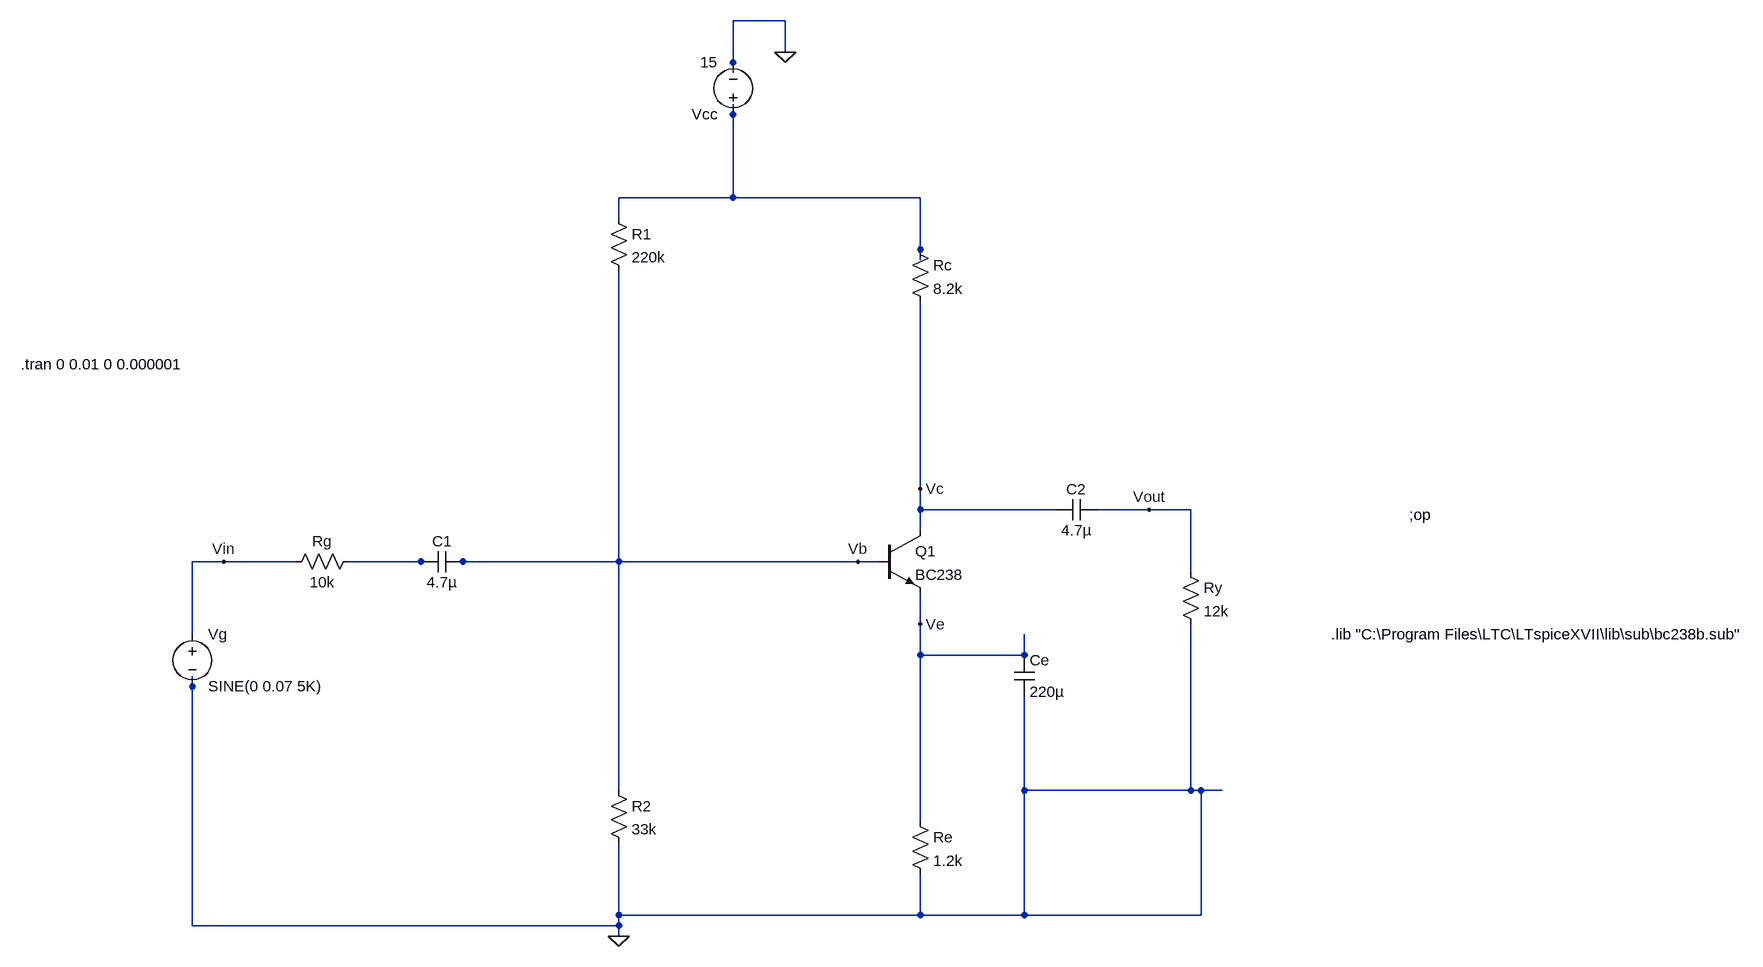
[diagram p0: schematic bjt trimmer simulation.asc]
bjt trimmer simulation.asc, the LTspice schematic file:
Version 4
SHEET 1 2680 740
WIRE 688 -688 608 -688
WIRE 688 -640 688 -688
WIRE 608 -624 608 -688
WIRE 608 -608 608 -624
WIRE 608 -544 608 -560
WIRE 608 -416 608 -544
WIRE 608 -416 432 -416
WIRE 896 -416 608 -416
WIRE 432 -384 432 -416
WIRE 896 -336 896 -416
WIRE 896 -320 896 -336
WIRE 896 32 896 -256
WIRE 896 64 896 32
WIRE 1104 64 896 64
WIRE 1248 64 1168 64
WIRE 1312 64 1248 64
WIRE 896 96 896 64
WIRE -176 144 -224 144
WIRE -64 144 -176 144
WIRE 128 144 16 144
WIRE 144 144 128 144
WIRE 192 144 176 144
WIRE 432 144 432 -304
WIRE 432 144 192 144
WIRE 800 144 432 144
WIRE 832 144 800 144
WIRE 1312 160 1312 64
WIRE 896 240 896 192
WIRE -224 256 -224 144
WIRE 896 288 896 240
WIRE 1056 288 1056 256
WIRE 1056 288 896 288
WIRE -224 336 -224 320
WIRE 432 496 432 144
WIRE 1056 496 1056 352
WIRE 1312 496 1312 240
WIRE 1312 496 1056 496
WIRE 1328 496 1312 496
WIRE 1360 496 1328 496
WIRE 896 544 896 288
WIRE 432 688 432 576
WIRE 896 688 896 624
WIRE 896 688 432 688
WIRE 1056 688 1056 496
WIRE 1056 688 896 688
WIRE 1328 688 1328 496
WIRE 1328 688 1056 688
WIRE -224 704 -224 336
WIRE 432 704 432 688
WIRE 432 704 -224 704
WIRE 432 720 432 704
FLAG 432 720 0
FLAG 688 -640 0
FLAG 800 144 Vb
FLAG 896 240 Ve
FLAG 896 32 Vc
FLAG 1248 64 Vout
FLAG -176 144 Vin
DATAFLAG 672 144 ""
DATAFLAG 896 368 ""
DATAFLAG 896 -112 ""
DATAFLAG -224 496 ""
SYMBOL res 32 128 R90
WINDOW 0 0 56 VBottom 2
WINDOW 3 32 56 VTop 2
SYMATTR InstName Rg
SYMATTR Value 10k
SYMBOL res 416 480 R0
SYMATTR InstName R2
SYMATTR Value 33k
SYMBOL res 416 -400 R0
SYMATTR InstName R1
SYMATTR Value 220k
SYMBOL res 880 -352 R0
SYMATTR InstName Rc
SYMATTR Value 8.2k
SYMBOL res 880 528 R0
SYMATTR InstName Re
SYMATTR Value 1.2k
SYMBOL res 1296 144 R0
SYMATTR InstName Ry
SYMATTR Value 12k
SYMBOL cap 1168 48 R90
WINDOW 0 0 32 VBottom 2
WINDOW 3 32 32 VTop 2
SYMATTR InstName C2
SYMATTR Value 4.7µ
SYMBOL cap 192 128 R90
WINDOW 0 0 32 VBottom 2
WINDOW 3 32 32 VTop 2
SYMATTR InstName C1
SYMATTR Value 4.7µ
SYMBOL cap 1040 288 R0
SYMATTR InstName Ce
SYMATTR Value 220µ
SYMBOL voltage -224 240 R0
WINDOW 123 0 0 Left 0
WINDOW 39 0 0 Left 0
SYMATTR InstName Vg
SYMATTR Value SINE(0 0.07 5K)
SYMBOL voltage 608 -528 R180
WINDOW 123 0 0 Left 0
WINDOW 39 0 0 Left 0
SYMATTR InstName Vcc
SYMATTR Value 15
SYMBOL npn 832 96 R0
SYMATTR InstName Q1
SYMATTR Value BC238
TEXT 1648 72 Left 2 !;op
TEXT 1528 256 Left 2 !.lib "C:\\Program Files\\LTC\\LTspiceXVII\\lib\\sub\\bc238b.sub"
TEXT -488 -160 Left 2 !.tran 0 0.01 0 0.000001

The netlist it stands for:
* bjt trimmer simulation.asc
Rg N002 Vin 10k
R2 Vb 0 33k
R1 N001 Vb 220k
Rc N001 Vc 8.2k
Re Ve 0 1.2k
Ry Vout 0 12k
C2 Vout Vc 4.7µ
C1 Vb N002 4.7µ
Ce Ve 0 220µ
Vg Vin 0 SINE(0 0.07 5K)
Vcc N001 0 15
Q1 Vc Vb Ve 0 BC238
.model NPN NPN
.model PNP PNP
.lib standard.bjt
;op
.lib "C:\Program Files\LTC\LTspiceXVII\lib\sub\bc238b.sub"
.tran 0 0.01 0 0.000001
.backanno
.end